# Altium project PCB_Project.PrjPcb (part 3 of 3)
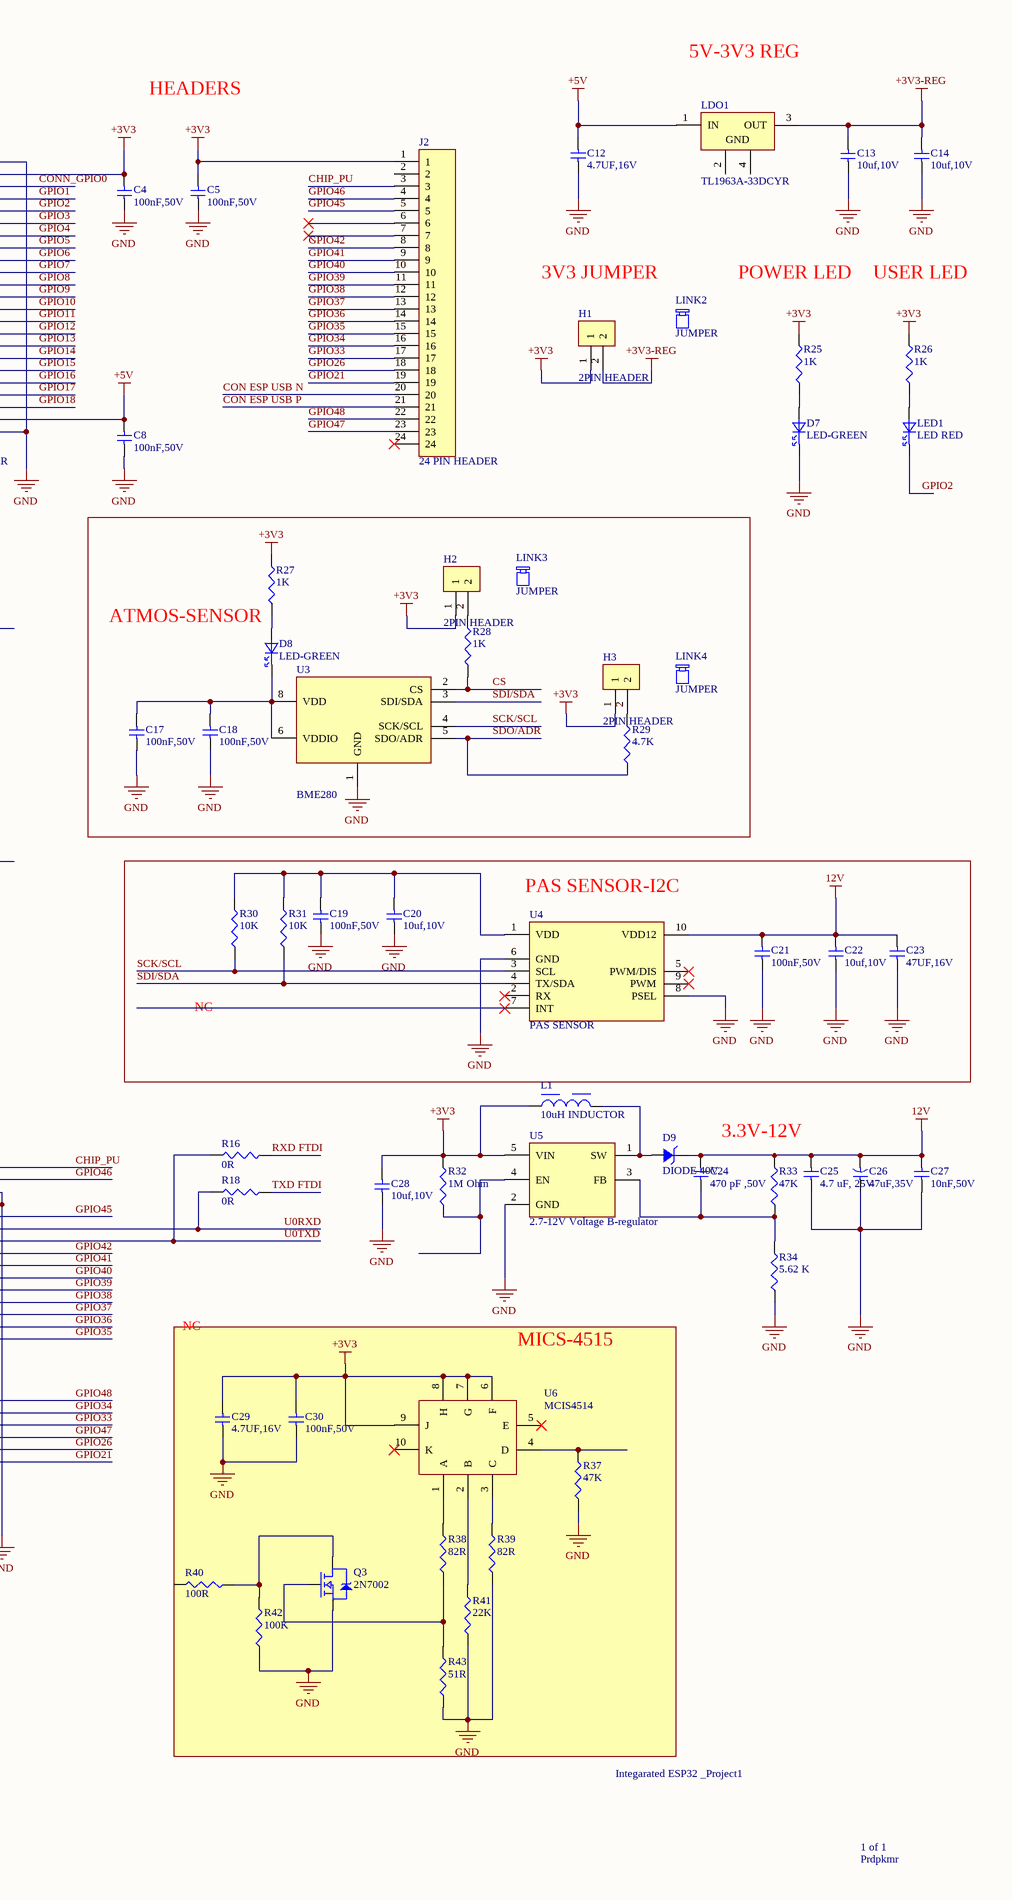
[diagram p3: esp.SchDoc, right]

## Sheet esp.SchDoc (continued)

### Library data of the parts (continued)
R41 = CRGCQ0402F22K: RES 22K OHM 1% 1/16W 0402; Manufacturer: TE Connectivity; Max Power Dissipation: 63mW; Temperature Coefficient: 100ppm/°C; Value: 22kR; Power Rating: 62.5mW; Voltage Rating: 50V; Supplier: Avnet; Supplier Part Number: 73AC8868; Manufacturer Part Number: CRGCQ0402F22K; RoHS: Yes; Category: Chip SMD Resistors; Stock: 20000; Pricing: 1=0.049, 25=0.014, 100=0.007, 250=0.006, 1000=0.005 (USD); Case/Package: 0402; Min Operating Temperature: -55°C; Max Operating Temperature: 155°C; Features: Moisture Resistant,Automotive AEC-Q200; Series: CRGCQ; Tolerance: 1%; Number of Terminations: 2; Packaging: Cut Tape; Voltage Rating (DC): 50V; Operating Supply Voltage: 50V; Height: 400um; Ratings: AEC-Q200; RoHS Compliant: Yes; ComponentLink1URL: http://datasheet.octopart.com/CRGCQ0402F22K-TE-Connectivity-datasheet-114679081.pdf?src-supplier=Digikey; ComponentLink1Description: http://datasheet.octopart.com/CRGCQ0402F22K-TE-Connectivity-datasheet-114679081.pdf?src-supplier=Digikey; ComponentLink2URL: https://4donline.ihs.com/images/VipMasterIC/IC/TYEL/TYEL-S-A0004929575/TYEL-S-A0004929575-1.pdf?hkey=52A5661711E402568146F3353EA87419&src-supplier=Farnell; ComponentLink2Description: https://4donline.ihs.com/images/VipMasterIC/IC/TYEL/TYEL-S-A0004929575/TYEL-S-A0004929575-1.pdf?hkey=52A5661711E402568146F3353EA87419&src-supplier=Farnell; ComponentLink3URL: http://datasheet.octopart.com/CRGCQ0402F22K-TE-Connectivity-datasheet-114679081.pdf?src-supplier=Avnet; ComponentLink3Description: http://datasheet.octopart.com/CRGCQ0402F22K-TE-Connectivity-datasheet-114679081.pdf?src-supplier=Avnet; ComponentLink4URL: http://datasheet.octopart.com/CRGCQ0402F22K-TE-Connectivity-datasheet-114679081.pdf?src-supplier=Mouser; ComponentLink4Description: http://datasheet.octopart.com/CRGCQ0402F22K-TE-Connectivity-datasheet-114679081.pdf?src-supplier=Mouser; ComponentLink5URL: http://datasheet.octopart.com/CRGCQ0402F22K-TE-Connectivity-datasheet-114679081.pdf?src-supplier=Onlinecomponents.com; ComponentLink5Description: http://datasheet.octopart.com/CRGCQ0402F22K-TE-Connectivity-datasheet-114679081.pdf?src-supplier=Onlinecomponents.com; ComponentLink6URL: https://4donline.ihs.com/images/VipMasterIC/IC/TYEL/TYEL-S-A0004929575/TYEL-S-A0004929575-1.pdf?hkey=52A5661711E402568146F3353EA87419&src-supplier=Newark; ComponentLink6Description: https://4donline.ihs.com/images/VipMasterIC/IC/TYEL/TYEL-S-A0004929575/TYEL-S-A0004929575-1.pdf?hkey=52A5661711E402568146F3353EA87419&src-supplier=Newark; ComponentLink7URL: http://datasheet.octopart.com/CRGCQ0402F22K-TE-Connectivity-datasheet-114679081.pdf?src-supplier=Newark; ComponentLink7Description: http://datasheet.octopart.com/CRGCQ0402F22K-TE-Connectivity-datasheet-114679081.pdf?src-supplier=Newark; ComponentLink8URL: http://datasheet.octopart.com/CRGCQ0402F22K-TE-Connectivity-datasheet-114679081.pdf?src-supplier=Heilind+Electronics; ComponentLink8Description: http://datasheet.octopart.com/CRGCQ0402F22K-TE-Connectivity-datasheet-114679081.pdf?src-supplier=Heilind+Electronics; ComponentLink9URL: http://datasheet.octopart.com/CRGCQ0402F22K-TE-Connectivity-datasheet-114679081.pdf?src-supplier=Sager+Electronics; ComponentLink9Description: http://datasheet.octopart.com/CRGCQ0402F22K-TE-Connectivity-datasheet-114679081.pdf?src-supplier=Sager+Electronics; ComponentLink10URL: http://datasheet.octopart.com/CRGCQ0402F22K-TE-Connectivity-datasheet-114679081.pdf?src-supplier=Interstate+Connecting+Components; ComponentLink10Description: http://datasheet.octopart.com/CRGCQ0402F22K-TE-Connectivity-datasheet-114679081.pdf?src-supplier=Interstate+Connecting+Components; ComponentLink11URL: http://datasheet.octopart.com/CRGCQ0402F22K-TE-Connectivity-datasheet-114679081.pdf?src-supplier=Electro+Sonic; ComponentLink11Description: http://datasheet.octopart.com/CRGCQ0402F22K-TE-Connectivity-datasheet-114679081.pdf?src-supplier=Electro+Sonic; ComponentLink12URL: https://datasheet.octopart.com/CRGCQ0402F22K-TE-Connectivity-datasheet-114679081.pdf?src-supplier=Master+Electronics; ComponentLink12Description: https://datasheet.octopart.com/CRGCQ0402F22K-TE-Connectivity-datasheet-114679081.pdf?src-supplier=Master+Electronics; ComponentLink13URL: http://datasheet.octopart.com/CRGCQ0402F22K-TE-Connectivity-datasheet-114679081.pdf?src-supplier=TME; ComponentLink13Description: http://datasheet.octopart.com/CRGCQ0402F22K-TE-Connectivity-datasheet-114679081.pdf?src-supplier=TME; LCSC PART Number: C2073567
R42 = RC0402FR-7W100KL: RES 100K OHM 1% 1/8W 0402; Manufacturer: Yageo; Value: 100kR; Supplier: Digikey; Supplier Part Number: 13-RC0402FR-7W100KLCT-ND; Manufacturer Part Number: RC0402FR-7W100KL; RoHS: Yes; Category: Chip SMD Resistors; Stock: 9078; Pricing: 1=0.1, 10=0.021, 100=0.0112, 1000=0.00612, 2500=0.0051, 5000=0.00443 (USD); Case/Package: 0402; Packaging: Tape and Reel; RoHS Compliant: Yes; LCSC PART Number: C606167
R43 = RT0402DRE0751RL: RES SMD 51 OHM 0.5% 1/16W 0402; Manufacturer: Yageo; Max Power Dissipation: 63mW; Temperature Coefficient: 50ppm/°C; Voltage Rating (DC): 50V; Supplier: Digikey; Supplier Part Number: 311-51UCT-ND; Manufacturer Part Number: RT0402DRE0751RL; RoHS: Yes; Category: Chip SMD Resistors; Stock: 1712; Pricing: 1=0.1, 10=0.051, 50=0.0494, 100=0.0479, 500=0.03672, 1000=0.03264 (USD); Case/Package: 0402; Case Code (Metric): 1005; Case Code (Imperial): 0402; Min Operating Temperature: -55°C; Max Operating Temperature: 155°C; Value: 51R; Tolerance: 0.5%; Packaging: Cut Tape; Number of Terminations: 2; Series: RT; Lead Free: Lead Free; RoHS Compliant: Yes; ComponentLink1URL: https://www.yageo.com/upload/media/product/productsearch/datasheet/rchip/PYu-RT_1-to-0.01_RoHS_L_11.pdf?src-supplier=Digikey; ComponentLink1Description: https://www.yageo.com/upload/media/product/productsearch/datasheet/rchip/PYu-RT_1-to-0.01_RoHS_L_11.pdf?src-supplier=Digikey; ComponentLink2URL: http://www.yageo.com/documents/recent/PYu-RT_1-to-0.01_RoHS_L_9.pdf?src-supplier=Digikey; ComponentLink2Description: http://www.yageo.com/documents/recent/PYu-RT_1-to-0.01_RoHS_L_9.pdf?src-supplier=Digikey; ComponentLink3URL: https://datasheet.octopart.com/RT0402DRE0751RL-Yageo-datasheet-169971040.pdf?src-supplier=Future+Electronics; ComponentLink3Description: https://datasheet.octopart.com/RT0402DRE0751RL-Yageo-datasheet-169971040.pdf?src-supplier=Future+Electronics; LCSC PART Number: C853981
SW1 SW2 = PTS645SH50SMTR92LFS: SWITCH TACTILE SPST-NO 0.05A 12V; Manufacturer: ITT C&K; Mechanical Life: 100000Cycles; Actuator Material: Nylon,Polyamide,PA66; Operating Force: 200gf; Throw Configuration: SPST; Current Rating: 50mA; Illumination Type: Non-Illuminated,Illuminated; Switch Function: Off-Mom; Actuator Type: Standard; Contact Resistance: 100mR; Number of Positions: 2; Supplier: Digikey; Supplier Part Number: CKN9085CT-ND; Manufacturer Part Number: PTS645SH50SMTR92LFS; RoHS: Yes; Category: Tactile Switches; Stock: 17094; Pricing: 1=0.33, 10=0.285, 25=0.2692, 100=0.2476, 250=0.23404, 500=0.22418, 1000=0.21467, 2000=0.20552, 3000=0.20033, 5000=0.19395, 7000=0.18986, 10000=0.18561, 25000=0.17508, 50000=0.1675 (USD); Mounting Technology: Surface Mount; Case/Package: SMD/SMT; Contact Plating: Silver; Contact Material: Bronze; Color: Black; Min Operating Temperature: -20°C; Max Operating Temperature: 60°C; Packaging: Tape and Reel; Max Voltage Rating (DC): 12V; Termination: Gull Wing; Voltage Rating (DC): 12V; Package Quantity: 1000; Max Current Rating: 50mA; Orientation: Straight; Series: PTS645; Contact Current Rating: 50mA; Length: 6mm; Depth: 9mm; Reach SVHC Compliant: No; Lead Free: Lead Free; RoHS Compliant: Yes; ComponentLink1URL: https://datasheet.ciiva.com/29903/getdatasheetpartid-773702-29903807.pdf?src-supplier=Verical; ComponentLink1Description: https://datasheet.ciiva.com/29903/getdatasheetpartid-773702-29903807.pdf?src-supplier=Verical; ComponentLink2URL: https://datasheet.ciiva.com/14920/pts645-14920741.pdf?src-supplier=Digikey; ComponentLink2Description: https://datasheet.ciiva.com/14920/pts645-14920741.pdf?src-supplier=Digikey; ComponentLink3URL: https://datasheet.ciiva.com/22637/1707731-22637356.pdf?src-supplier=Element14; ComponentLink3Description: https://datasheet.ciiva.com/22637/1707731-22637356.pdf?src-supplier=Element14; LCSC PART Number: C221869
U1 = ESP32-S3-MINI-1-N8: 20.5dBm ESP32-S3FN8 Chip 2.4GHz SMD WiFi Modules ROHS; Manufacturer: Espressif Systems; Supplier: Digikey; Supplier Part Number: 1965-ESP32-S3-MINI-1-N8CT-ND; Manufacturer Part Number: ESP32-S3-MINI-1-N8; RoHS: No; Category: LDO; Stock: 12636; Pricing: 1=5.28, 10=4.566, 25=4.3196, 100=3.9802, 250=3.7768, 650=3.58103, 1300=3.44874, 1950=3.37497 (USD); ComponentLink1URL: https://datasheet.octopart.com/ESP32-S3-MINI-1-N8-Espressif-Systems-datasheet-165560562.pdf?src-supplier=TME; ComponentLink1Description: https://datasheet.octopart.com/ESP32-S3-MINI-1-N8-Espressif-Systems-datasheet-165560562.pdf?src-supplier=TME; LCSC PART Number: C2913206
U2 = FT231XQ-R: IC USB SERIAL FULL UART 20QFN; Manufacturer: FTDI; Data Rate: 12Mbps; Number of Channels: 1; Max Supply Voltage: 5.5V; Min Supply Voltage: 2.97V; Interface: UART,USB; Operating Supply Current: 8mA; Supplier: Digikey; Supplier Part Number: 768-1128-1-ND; Manufacturer Part Number: FT231XQ-R; RoHS: Yes; Category: Interface ICs; Stock: 41705; Pricing: 1=2.34, 25=2.27, 100=2.2, 250=2, 500=1.82002, 1000=1.7625, 5000=1.7625 (USD); Mounting Technology: Surface Mount; Case/Package: QFN; Pins: 20; Weight: 0.004339oz; Min Operating Temperature: -40°C; Max Operating Temperature: 85°C; Packaging: Tape and Reel; Series: USBmadeEZ-UART, FT-X, X-Chip; Height: 800um; Lead Free: Lead Free; RoHS Compliant: Yes; ComponentLink1URL: https://datasheet.ciiva.com/1787/ds-ft231x-1787312.pdf?src-supplier=Digikey; ComponentLink1Description: https://datasheet.ciiva.com/1787/ds-ft231x-1787312.pdf?src-supplier=Digikey; ComponentLink2URL: https://datasheet.ciiva.com/30475/0900766b811020d3-30475405.pdf?src-supplier=Rs; ComponentLink2Description: https://datasheet.ciiva.com/30475/0900766b811020d3-30475405.pdf?src-supplier=Rs; ComponentLink3URL: https://datasheet.ciiva.com/4787/ds-ft231x-13571-4787570.pdf?src-supplier=Mouser; ComponentLink3Description: https://datasheet.ciiva.com/4787/ds-ft231x-13571-4787570.pdf?src-supplier=Mouser; ComponentLink4URL: https://datasheet.ciiva.com/1787/ft-x-series-1787313.pdf?src-supplier=Digikey; ComponentLink4Description: https://datasheet.ciiva.com/1787/ft-x-series-1787313.pdf?src-supplier=Digikey; ComponentLink5URL: https://datasheet.ciiva.com/1787/ft-x-series-1787314.pdf?src-supplier=Digikey; ComponentLink5Description: https://datasheet.ciiva.com/1787/ft-x-series-1787314.pdf?src-supplier=Digikey; LCSC PART Number: C132159
U3 = BME280: SENSOR PRESSURE HUMIDITY TEMP; Manufacturer: Bosch Tools; Supplier: Digikey; Supplier Part Number: 828-1063-1-ND; Manufacturer Part Number: BME280; RoHS: No; Category: Linear ICs; Stock: 15872; Pricing: 1=4.17, 5=3.734, 10=3.573, 25=3.3808, 50=3.2492, 100=3.1285, 500=2.88584, 1000=2.79544, 10000=2.5454 (USD); Case/Package: LGA; Pins: 8; Min Operating Temperature: -40°C; Max Operating Temperature: 85°C; Lead Free: Lead Free; LCSC PART Number: C92489
U4 = PASCO2V01BUMA1: SENSOR CARBON DIOXIDE I2C OUTPUT; Manufacturer: Infineon; Supplier: Mouser; Supplier Part Number: 726-PASCO2V01BUMA1; Manufacturer Part Number: PASCO2V01BUMA1; RoHS: No; Stock: 274; Pricing: 1=27.8, 10=26.67, 50=25.34, 100=24.46, 1000=23.66, 10000=23.66 (USD); LCSC PART Number: C6352077
U5 = LMR62421XMFX/NOPB: IC REG BST SEPIC ADJ 2.1A SOT23; Manufacturer: TI National Semiconductor; Switching Frequency: 1.6MHz; Output Voltage: 24V; Min Input Voltage: 2.7V; Number of Outputs: 1; Max Supply Voltage: 5.5V; Synchronous Rectifier: No; Quiescent Current: 7mA; Topology: Boost,SEPIC; Output Type: Adjustable; Output Configuration: Positive; Number of Channels: 1NUMBER; Supplier: Mouser; Supplier Part Number: 926-LMR62421XMFXNOPB; Manufacturer Part Number: LMR62421XMFX/NOPB; RoHS: Yes; Category: Voltage Regulators - Switching; Stock: 3949; Pricing: 1=1.29, 10=0.938, 50=0.85, 100=0.753, 1000=0.627, 10000=0.583 (USD); Mounting Technology: Surface Mount; Case/Package: SOT-23-5; Pins: 5; Min Operating Temperature: -40°C; Max Operating Temperature: 125°C; Output Current: 2.1A; Packaging: Tape and Reel; Package Quantity: 3000; Min Output Voltage: 2.7V; Max Output Voltage: 24V; Series: SIMPLE SWITCHER®; Length: 2.9mm; Width: 1.6mm; Height: 1.45mm; Thickness: 1.2mm; Lead Free: Lead Free; RoHS Compliant: Yes; ComponentLink1URL: https://datasheet.ciiva.com/4880/snvs734a-74088-4880547.pdf?src-supplier=Mouser; ComponentLink1Description: https://datasheet.ciiva.com/4880/snvs734a-74088-4880547.pdf?src-supplier=Mouser; LCSC PART Number: C544413
U6 = MICS-4514: SENSOR CARBON MONOXIDE; Manufacturer: SGX Sensortech; Supplier: Newark; Supplier Part Number: 71AC1526; Manufacturer Part Number: MICS-4514; RoHS: No; Category: Linear ICs; Stock: 9; Pricing: 1=14.88, 5=14.88, 10=14.88, 25=14.88, 50=13.82, 100=12.9, 250=12.9 (USD); Case/Package: QFN; Min Operating Temperature: -30°C; Max Operating Temperature: 85°C; ComponentLink1URL: https://datasheet.octopart.com/MICS-4514-SGX-Sensortech-datasheet-41926419.pdf?src-supplier=SOS+electronic; ComponentLink1Description: https://datasheet.octopart.com/MICS-4514-SGX-Sensortech-datasheet-41926419.pdf?src-supplier=SOS+electronic; ComponentLink2URL: https://datasheet.octopart.com/MICS-4514-SGX-Sensortech-datasheet-99856667.pdf?src-supplier=Component+Distributors+Inc.; ComponentLink2Description: https://datasheet.octopart.com/MICS-4514-SGX-Sensortech-datasheet-99856667.pdf?src-supplier=Component+Distributors+Inc.; ComponentLink3URL: https://datasheet.octopart.com/MICS-4514-SGX-Sensortech-datasheet-41926419.pdf?src-supplier=Master+Electronics; ComponentLink3Description: https://datasheet.octopart.com/MICS-4514-SGX-Sensortech-datasheet-41926419.pdf?src-supplier=Master+Electronics; LCSC PART Number: C3659364